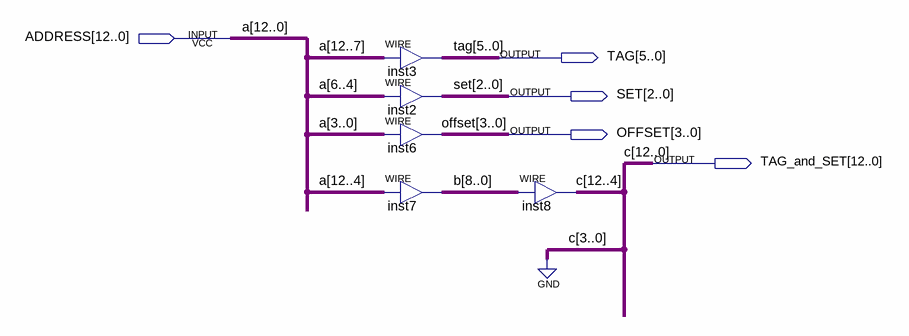
[diagram p0: schematic sheet]
// Quartus schematic Decode_Set_Of.bdf as structural Verilog: 5 symbols, 5 pins
module Decode_Set_Of (
  input  [12:0] ADDRESS,
  output [5:0] TAG,
  output [2:0] SET,
  output [3:0] OFFSET,
  output [12:0] TAG_and_SET
);

  wire [8:0] b;

  assign TAG = ADDRESS[12:7];  // WIRE inst3
  assign SET = ADDRESS[6:4];  // WIRE inst2
  assign OFFSET = ADDRESS[3:0];  // WIRE inst6
  assign b = ADDRESS[12:4];  // WIRE inst7
  assign TAG_and_SET[12:4] = b;  // WIRE inst8

  assign TAG_and_SET[3:0] = 4'b0000;

  // Other names for the same wires on the sheet: a[12:0] = ADDRESS; c[12:4] = TAG_and_SET[12:4]
endmodule
